# EAGLE design pic_can_relay (EAGLE 6.5.0)
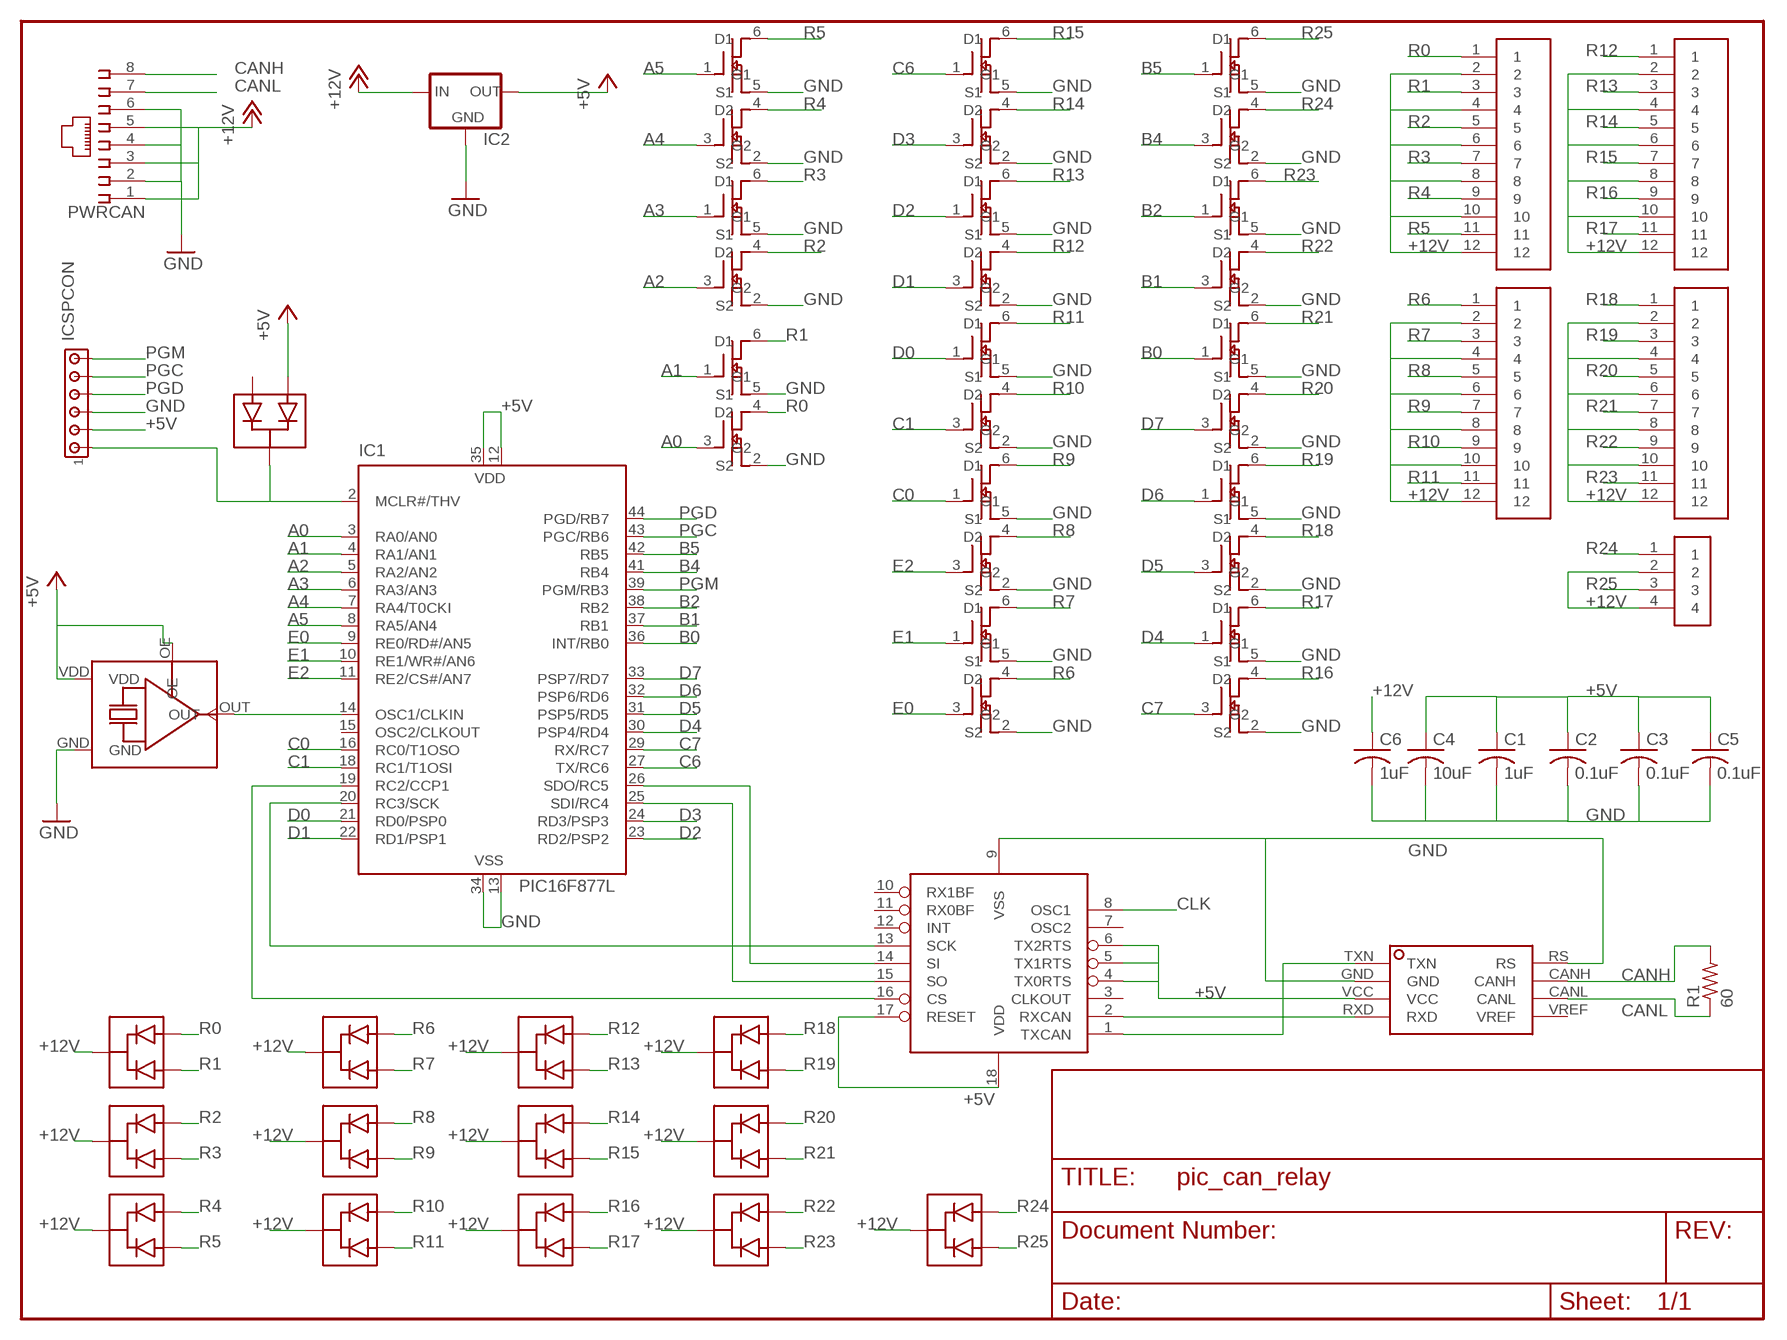
[diagram p0: schematic, sheet 1]

## Parts
C1  1uF  C-USC1206  [C1206]
C2  0.1uF  C-USC0805  [C0805]
C3  0.1uF  C-USC0805  [C0805]
C4  10uF  C-USC1210  [C1210]
C5  0.1uF  C-USC0805  [C0805]
C6  1uF  C-USC1206  [C1206]
D1  BAV70_  [SOT-23]
D2  BAV70_  [SOT-23]
D3  BAV70_  [SOT-23]
D4  BAV70_  [SOT-23]
D5  BAV70_  [SOT-23]
D6  BAV70_  [SOT-23]
D7  BAV70_  [SOT-23]
D8  BAV70_  [SOT-23]
D9  BAV70_  [SOT-23]
D10  BAV70_  [SOT-23]
D11  BAV70_  [SOT-23]
D12  BAV70_  [SOT-23]
D13  BAV70_  [SOT-23]
D14  BAV70_  [SOT-23]
IC1  PIC16F877L  [PLCC-44]
IC2  78XXL  [78XXL]
IC3  UC5350D  [SOIC8]
ICSPCON  MTA06-100  [10X06MTA]
MCP1  MCP2510-I/SO  [SO-18W]
PWRCAN  555764-1  [555764-1]
R1  60  R-US_R0805  [R0805]
T1  NDC7002N"  [SOT-6]
T2  NDC7002N"  [SOT-6]
T3  NDC7002N"  [SOT-6]
T4  NDC7002N"  [SOT-6]
T5  NDC7002N"  [SOT-6]
T6  NDC7002N"  [SOT-6]
T7  NDC7002N"  [SOT-6]
T8  NDC7002N"  [SOT-6]
T9  NDC7002N"  [SOT-6]
T10  NDC7002N"  [SOT-6]
T11  NDC7002N"  [SOT-6]
T12  NDC7002N"  [SOT-6]
T13  NDC7002N"  [SOT-6]
TB1  MPT0.5/12-2.54  [MPT0.5/12-2.54]
TB2  MPT0.5/12-2.54  [MPT0.5/12-2.54]
TB3  MPT0.5/12-2.54  [MPT0.5/12-2.54]
TB4  MPT0.5/12-2.54  [MPT0.5/12-2.54]
TB5  MPT0.5/4-2.54"  [MPT0.5/4-2.54]
U$1  SG-615P  [SG-615]

## Nets
+5V: C1.1 C2.1 C3.1 C4.1 C5.1 D1.1(A1) IC1.12(VDD) IC1.35(VDD) IC2.OUT IC3.VCC ICSPCON.5 MCP1.4(TX0RTS) MCP1.5(TX1RTS) MCP1.6(TX2RTS) MCP1.17(RESET) MCP1.18(VDD) U$1.OE U$1.VDD
+12V: C6.1 D2.3(C) D3.3(C) D4.3(C) D5.3(C) D6.3(C) D7.3(C) D8.3(C) D9.3(C) D10.3(C) D11.3(C) D12.3(C) D13.3(C) D14.3(C) IC2.IN PWRCAN.1 PWRCAN.3 PWRCAN.5 TB1.2 TB1.4 TB1.6 TB1.8 TB1.10 TB1.12 TB2.2 TB2.4 TB2.6 TB2.8 TB2.10 TB2.12 TB3.2 TB3.4 TB3.6 TB3.8 TB3.10 TB3.12 TB4.2 TB4.4 TB4.6 TB4.8 TB4.10 TB4.12 TB5.2 TB5.4
A0: IC1.3(RA0/AN0) T1.3(G2)
A1: IC1.4(RA1/AN1) T1.1(G1)
A2: IC1.5(RA2/AN2) T2.3(G2)
A3: IC1.6(RA3/AN3) T2.1(G1)
A4: IC1.7(RA4/T0CKI) T3.3(G2)
A5: IC1.8(RA5/AN4) T3.1(G1)
B0: IC1.36(INT/RB0) T11.1(G1)
B1: IC1.37(RB1) T12.3(G2)
B2: IC1.38(RB2) T12.1(G1)
B4: IC1.41(RB4) T13.3(G2)
B5: IC1.42(RB5) T13.1(G1)
C0: IC1.16(RC0/T1OSO) T5.1(G1)
C1: IC1.18(RC1/T1OSI) T6.3(G2)
C6: IC1.27(TX/RC6) T8.1(G1)
C7: IC1.29(RX/RC7) T9.3(G2)
CANH: IC3.CANH PWRCAN.8 R1.2
CANL: IC3.CANL PWRCAN.7 R1.1
CLK: IC1.14(OSC1/CLKIN) MCP1.8(OSC1) U$1.OUT
D0: IC1.21(RD0/PSP0) T6.1(G1)
D1: IC1.22(RD1/PSP1) T7.3(G2)
D2: IC1.23(RD2/PSP2) T7.1(G1)
D3: IC1.24(RD3/PSP3) T8.3(G2)
D4: IC1.30(PSP4/RD4) T9.1(G1)
D5: IC1.31(PSP5/RD5) T10.3(G2)
D6: IC1.32(PSP6/RD6) T10.1(G1)
D7: IC1.33(PSP7/RD7) T11.3(G2)
E0: IC1.9(RE0/RD#/AN5) T4.3(G2)
E1: IC1.10(RE1/WR#/AN6) T4.1(G1)
E2: IC1.11(RE2/CS#/AN7) T5.3(G2)
GND: C1.2 C2.2 C3.2 C4.2 C5.2 C6.2 IC1.13(VSS) IC1.34(VSS) IC2.GND IC3.GND IC3.RS ICSPCON.4 MCP1.9(VSS) PWRCAN.2 PWRCAN.4 PWRCAN.6 T1.2(S2) T1.5(S1) T2.2(S2) T2.5(S1) T3.2(S2) T3.5(S1) T4.2(S2) T4.5(S1) T5.2(S2) T5.5(S1) T6.2(S2) T6.5(S1) T7.2(S2) T7.5(S1) T8.2(S2) T8.5(S1) T9.2(S2) T9.5(S1) T10.2(S2) T10.5(S1) T11.2(S2) T11.5(S1) T12.2(S2) T12.5(S1) T13.2(S2) T13.5(S1) U$1.GND
N$3: IC1.25(SDI/RC4) MCP1.15(SO)
N$4: IC1.26(SDO/RC5) MCP1.14(SI)
N$5: IC1.20(RC3/SCK) MCP1.13(SCK)
N$6: D1.3(C) IC1.2(MCLR#/THV) ICSPCON.6
N$7: IC3.TXN MCP1.1(TXCAN)
N$8: IC3.RXD MCP1.2(RXCAN)
N$12: IC1.19(RC2/CCP1) MCP1.16(CS)
PGC: IC1.43(PGC/RB6) ICSPCON.2
PGD: IC1.44(PGD/RB7) ICSPCON.3
PGM: IC1.39(PGM/RB3) ICSPCON.1
R0: D2.2(A2) T1.4(D2) TB1.1
R1: D2.1(A1) T1.6(D1) TB1.3
R2: D3.2(A2) T2.4(D2) TB1.5
R3: D3.1(A1) T2.6(D1) TB1.7
R4: D4.2(A2) T3.4(D2) TB1.9
R5: D4.1(A1) T3.6(D1) TB1.11
R6: D5.2(A2) T4.4(D2) TB2.1
R7: D5.1(A1) T4.6(D1) TB2.3
R8: D6.2(A2) T5.4(D2) TB2.5
R9: D6.1(A1) T5.6(D1) TB2.7
R10: D7.2(A2) T6.4(D2) TB2.9
R11: D7.1(A1) T6.6(D1) TB2.11
R12: D8.2(A2) T7.4(D2) TB3.1
R13: D8.1(A1) T7.6(D1) TB3.3
R14: D9.2(A2) T8.4(D2) TB3.5
R15: D9.1(A1) T8.6(D1) TB3.7
R16: D10.2(A2) T9.4(D2) TB3.9
R17: D10.1(A1) T9.6(D1) TB3.11
R18: D11.2(A2) T10.4(D2) TB4.1
R19: D11.1(A1) T10.6(D1) TB4.3
R20: D12.2(A2) T11.4(D2) TB4.5
R21: D12.1(A1) T11.6(D1) TB4.7
R22: D13.2(A2) T12.4(D2) TB4.9
R23: D13.1(A1) T12.6(D1) TB4.11
R24: D14.2(A2) T13.4(D2) TB5.1
R25: D14.1(A1) T13.6(D1) TB5.3
Unconnected: D1.2(A2) IC1.15(OSC2/CLKOUT) IC3.VREF MCP1.3(CLKOUT) MCP1.7(OSC2) MCP1.10(RX1BF) MCP1.11(RX0BF) MCP1.12(INT)

## Library data of the parts
C1-C6 = rcl:C-US: CAPACITOR, American symbol
D1-D14 = house:BAV70: Fairchild Semiconductor Small Signal, Dual, Common Cathode, SOT-23 Diode
IC1 = microchip:PIC16F87*: MICROCONTROLLER
IC2 = v-reg:78XXL: VOLTAGE REGULATOR
IC3 = house:UC5350: CAN Tranceiver
ICSPCON = con-amp:MTA06-100: AMP CONNECTOR
MCP1 = microchip:MCP2510
PWRCAN = con-amp:555764-1: AMP CONNECTOR
R1 = rcl:R-US_: RESISTOR, American symbol
T1-T13 = house:NDC7002N: Farichild Dual N-Channel Enhancement Mode MOSFET
TB1-TB4 = house:MPT0.5: Pheonix Contact Micro-Pitch Terminal Block
TB5 = house:MPT0.5/4-2.54: Pheonix Contact Micro-Pitch Terminal Block
U$1 = house:SG-615: Epson Electronics CMOS/TTL SMD Oscillator

## Board
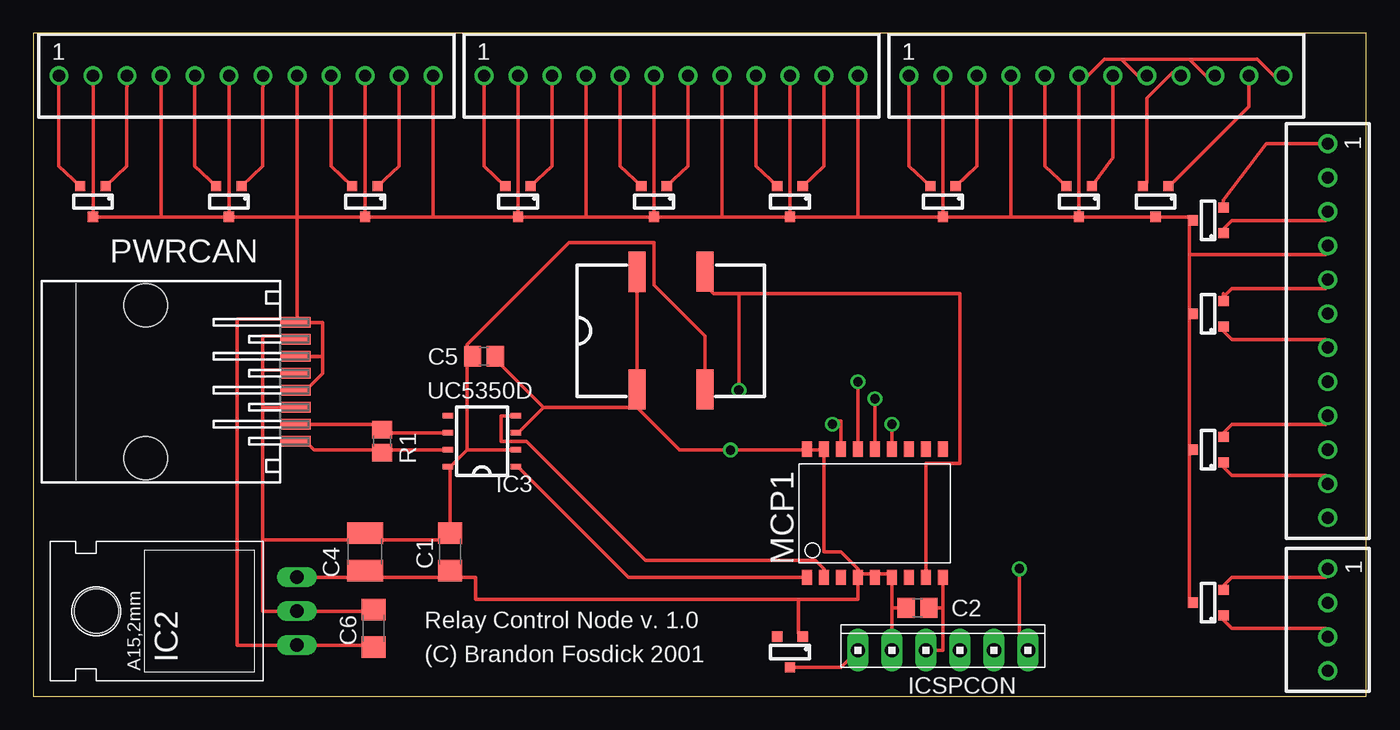
[diagram p1: board, top side]
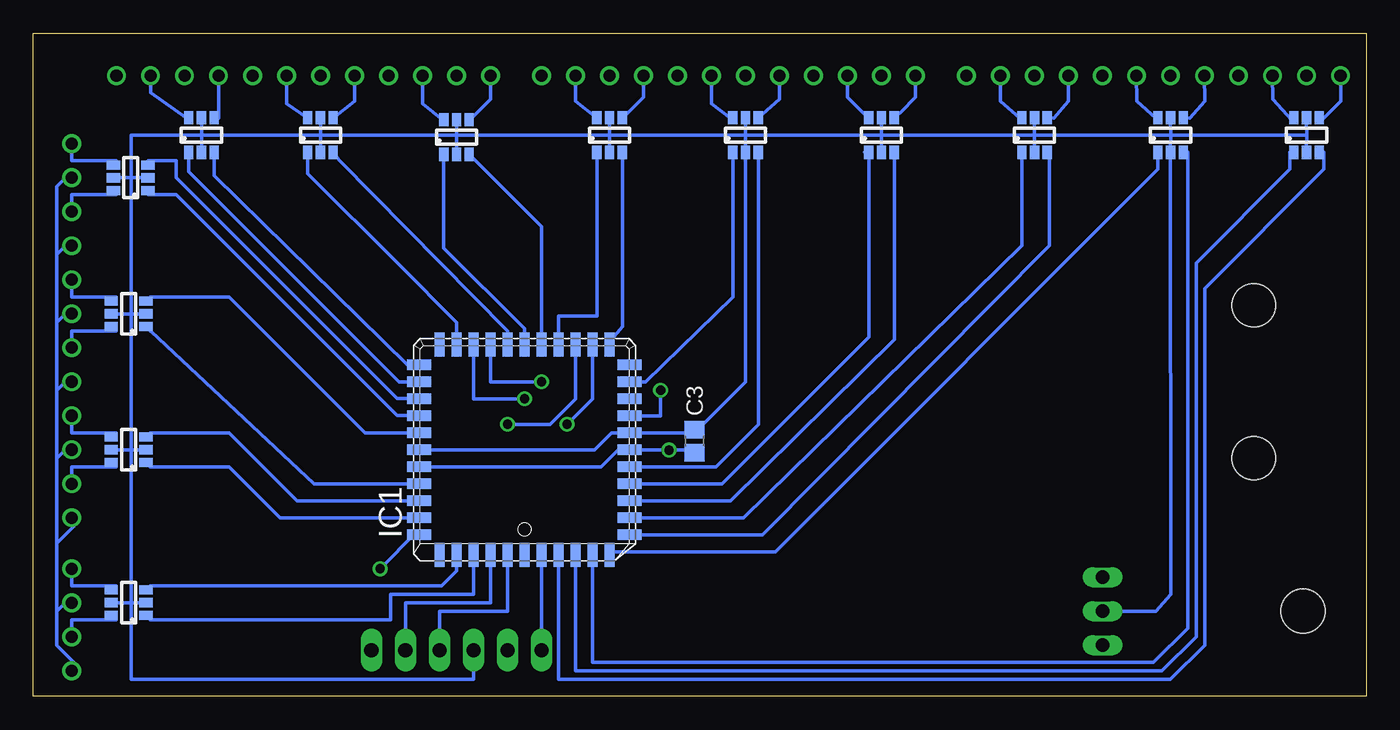
[diagram p2: board, bottom side, seen from below]

Size 99.55 x 49.55 mm. Coordinates in mm from the lower left corner, seen from the top.
Outline: 0,0 99.55,0 99.55,49.55 0,49.55 0,0
Copper layers (1*16): Top 0.035mm / dielectric 1.5mm / Bottom 0.035mm
Design rules "default": minimum track width 10mil, minimum drill 24mil, track to track 8mil, track to pad 8mil, pad to pad 8mil, via to via 8mil, smd to smd 8mil, copper to edge 40mil, drill to drill 8mil, minimum pad ring 10mil, minimum via ring 8mil, stop-mask expansion 0mil, vias tented up to drill 0mil, thermal gap 10mil

### Footprints (pad centres in the part's own frame; a part is rotated, then mirrored left to right if it is on the bottom)
C1206 = smd 1.6 x 1.8: 1 -1.4,0; 2 1.4,0
C0805 = smd 1.3 x 1.5: 1 -0.85,0; 2 0.85,0
C1210 = smd 1.6 x 2.7: 1 -1.4,0; 2 1.4,0
SOT-23 = smd 0.76 x 0.76: 1 -0.95,0; 2 0.95,0; 3 0,2.29
PLCC-44 = smd 1.8 x 0.76: 1 -7.86,0; 2 -7.86,-1.27; 3 -7.86,-2.54; 4 -7.86,-3.81; 5 -7.86,-5.08; 6 -7.86,-6.35; 18 7.86,-6.35; 19 7.86,-5.08; 20 7.86,-3.81; 21 7.86,-2.54; 22 7.86,-1.27; 23 7.86,0; 24 7.86,1.27; 25 7.86,2.54; 26 7.86,3.81; 27 7.86,5.08; 28 7.86,6.35; 40 -7.86,6.35; 41 -7.86,5.08; 42 -7.86,3.81; 43 -7.86,2.54; 44 -7.86,1.27 | smd 0.76 x 1.8: 7 -6.35,-7.86; 8 -5.08,-7.86; 9 -3.81,-7.86; 10 -2.54,-7.86; 11 -1.27,-7.86; 12 0,-7.86; 13 1.27,-7.86; 14 2.54,-7.86; 15 3.81,-7.86; 16 5.08,-7.86; 17 6.35,-7.86; 29 6.35,7.86; 30 5.08,7.86; 31 3.81,7.86; 32 2.54,7.86; 33 1.27,7.86; 34 0,7.86; 35 -1.27,7.86; 36 -2.54,7.86; 37 -3.81,7.86; 38 -5.08,7.86; 39 -6.35,7.86
78XXL = drill 1 long: GND 0,-3.81; IN -2.54,-3.81; OUT 2.54,-3.81 | hole 3.302: 0,11.176
SOIC8 = smd 0.813 x 0.406: CANH 2.54,1.27; CANL 2.54,0; GND -2.54,1.27; RS 2.54,2.54; RXD -2.54,-1.27; TXN -2.54,2.54; VCC -2.54,0; VREF 2.54,-1.27
10X06MTA = drill 1.067 long: 1 6.35,0; 2 3.81,0; 3 1.27,0; 4 -1.27,0; 5 -3.81,0; 6 -6.35,0
SO-18W = smd 0.762 x 1.143: 1 -5.08,-4.788; 2 -3.81,-4.788; 3 -2.54,-4.788; 4 -1.27,-4.788; 5 0,-4.788; 6 1.27,-4.788; 7 2.54,-4.788; 8 3.81,-4.788; 9 5.08,-4.788; 10 5.08,4.788; 11 3.81,4.788; 12 2.54,4.788; 13 1.27,4.788; 14 0,4.788; 15 -1.27,4.788; 16 -2.54,4.788; 17 -3.81,4.788; 18 -5.08,4.788
555764-1 = smd 0.813 x 2.286: 1 -4.445,10.033; 2 -3.175,10.033; 3 -1.905,10.033; 4 -0.635,10.033; 5 0.635,10.033; 6 1.905,10.033; 7 3.175,10.033; 8 4.445,10.033 | hole 3.251: -5.715,-1.143; 5.715,-1.143
R0805 = smd 1.3 x 1.5: 1 -0.85,0; 2 0.85,0
SOT-6 = smd 0.69 x 0.99: 1 -0.95,0; 2 0,0; 3 0.95,0; 4 0.95,2.59; 5 0,2.59; 6 -0.95,2.59
MPT0.5/12-2.54 = drill 0.9: 1 -12.7,0; 2 -10.16,0; 3 -7.62,0; 4 -5.08,0; 5 -2.54,0; 6 0,0; 7 2.54,0; 8 5.08,0; 9 7.62,0; 10 10.16,0; 11 12.7,0; 12 15.24,0
MPT0.5/4-2.54 = drill 0.9: 1 -5.08,0; 2 -2.54,0; 3 0,0; 4 2.54,0
SG-615 = smd 1.27 x 3: GND 2.54,-4.4; OE -2.54,-4.4; OUT 2.54,4.41; VDD -2.54,4.4

### Placement (x,y rotation side)
C1  31.11,10.82 90 top
C2  66.04,6.63 0 top
C3  50.16,19.08 90 bottom
C4  24.77,10.82 90 top
C5  33.66,25.43 180 top
C6  25.4,5.11 90 top
D1  56.52,4.47 180 top
D2  4.45,38.13 180 top
D3  14.61,38.13 180 top
D4  24.77,38.13 180 top
D5  36.2,38.13 180 top
D6  46.35,38.13 180 top
D7  56.52,38.13 180 top
D8  67.94,38.13 180 top
D9  78.11,38.13 180 top
D10  83.82,38.13 180 top
D11  88.9,35.59 90 top
D12  88.9,28.6 90 top
D13  88.9,18.44 90 top
D14  88.9,7.01 90 top
IC1  62.86,18.44 90 bottom
IC2  15.87,6.38 90 top
IC3  33.5,19.71 180 top
ICSPCON  67.94,3.46 0 top
MCP1  62.86,13.69 0 top
PWRCAN  9.52,23.52 270 top
R1  26.03,19.08 270 top
T1  4.45,40.67 0 bottom
T2  14.6,40.67 0 bottom
T3  24.76,40.67 0 bottom
T4  36.19,40.67 0 bottom
T5  46.35,40.67 0 bottom
T6  56.51,40.67 0 bottom
T7  67.94,40.51 0 bottom
T8  78.1,40.67 0 bottom
T9  86.99,40.67 0 bottom
T10  90.99,38.76 90 bottom
T11  91.14,28.6 90 bottom
T12  91.14,18.44 90 bottom
T13  91.14,7.01 90 bottom
TB1  14.6,46.38 0 top
TB2  46.35,46.38 0 top
TB3  78.1,46.38 0 top
TB4  96.7,28.6 270 top
TB5  96.7,4.47 270 top
U$1  47.62,27.33 0 top

### Tracks (layer width: path | path; a pad name or v marks a point on that pad's centre or on a via)
+5V  (via drill 0.7)
  Top 0.254: 62.7,9.16 61.43,9.16 MCP1.4 61.59,9.16 | 62.7,9.16 63.97,9.16 MCP1.6 64.13,9.16 64.13,6.62 | 62.7,9.16 MCP1.5 | 57.14,7.26 33.01,7.26 33.01,8.91 30.47,8.91 | 30.47,8.91 23.74,8.91 C4.1 23.5,8.89 20.95,8.89 IC2.OUT | 64.13,6.62 64.13,4.72 ICSPCON.5 | 61.59,9.16 61.59,7.26 57.14,7.26 | 57.14,7.26 56.51,7.26 57.14,7.26 | 57.14,7.26 57.14,4.72 D1.1 | 57.14,7.26 | 64.13,6.62 C2.1 | 30.47,8.91 C1.1 | U$1.VDD U$1.OE 45.09,21.59 | 38.1,21.59 36.2,19.68 IC3.VCC | 45.09,21.59 38.1,21.59 | 38.1,21.59 34.92,24.77 C5.1 | 59.05,18.41 57.78,18.41 | 57.78,18.41 v52.07,18.41 48.26,18.41 45.09,21.59 | 57.78,18.41 MCP1.18 | 59.05,18.41 59.05,10.79 60.33,10.79 61.59,9.53 61.59,9.16 | 59.05,18.41 MCP1.17
  Bottom 0.254: C3.1 50.79,18.44 52.07,18.44 | 52.07,18.44 IC1.12 55.88,18.41 57.15,17.14 69.85,17.14 | 71.12,17.14 IC1.35 69.85,17.14 | v52.07,18.41 52.07,18.44 | 69.85,17.14 70.48,17.14
+12V
  Top 0.254: 72.86,46.63 TB3.4 73.03,45.72 73.03,35.84 | TB3.2 67.94,46.63 | TB3.6 77.94,46.63 | 83.18,46.63 TB3.8 82.55,46.35 81.28,47.62 | 17.77,35.84 17.61,35.84 | 19.52,35.84 17.77,35.84 | 19.52,35.84 21.43,35.84 21.58,35.84 D4.3 | 16.5,28.21 19.68,28.21 | 16.5,28.21 | 19.68,28.21 19.68,37.1 | 19.68,28.21 PWRCAN.1 20.32,27.94 21.59,27.94 21.59,25.4 | 19.68,37.1 TB1.8 | D9.3 D10.3 | 86.35,35.84 86.35,33.02 | 86.35,33.02 86.35,28.85 | 86.35,28.85 D12.3 | D10.3 86.35,35.84 | D10.3 | 86.35,35.84 D11.3 | 17.77,35.84 D3.3 | D3.3 14.61,45.72 TB1.6 | 17.77,35.84 | D4.3 24.77,45.72 TB1.10 | D14.3 86.35,7.26 86.35,18.69 | 86.35,18.69 D13.3 | 4.44,45.99 TB1.2 4.45,45.72 D2.3 9.53,35.84 | 36.19,45.99 TB2.2 36.2,45.72 D5.3 | D5.3 41.27,35.84 | 41.27,35.84 D6.3 | D6.3 51.44,35.84 | 51.44,35.84 D7.3 | D7.3 56.52,45.72 TB2.10 | D6.3 46.35,45.72 TB2.6 | TB3.2 67.94,45.99 | 19.52,35.84 19.68,35.84 19.68,37.1 | D8.3 73.03,35.84 | 73.03,35.84 D9.3 | D9.3 78.11,45.72 TB3.6 | D8.3 67.94,45.72 TB3.2 | D4.3 29.84,35.84 | 29.84,35.84 D5.3 | D7.3 61.59,35.84 | 61.59,35.84 D8.3 | 86.35,28.85 86.35,18.69 | D3.3 9.53,35.84 | 16.5,28.21 15.23,28.21 15.23,3.83 IC2.IN 24.76,3.83 C6.1 | 16.5,28.21 | TB1.4 9.53,45.72 9.53,35.84 | TB1.12 29.84,45.72 29.84,35.84 | TB2.4 41.27,45.72 41.27,35.84 | TB2.8 51.44,45.72 51.44,35.84 | TB2.12 61.59,45.72 61.59,35.84 | 81.28,47.62 80.01,47.62 78.74,46.35 TB3.6 | 86.36,47.62 87.63,46.35 TB3.10 | 81.28,47.62 86.36,47.62 | 86.36,47.62 91.44,47.62 92.71,46.35 TB3.12 | TB4.4 96.52,33.02 86.35,33.02 | 21.59,25.4 21.59,24.13 20.32,22.86 PWRCAN.5 | 21.59,25.4 20.32,25.4 PWRCAN.3
  Bottom 0.254: 97.79,6.35 97.79,3.81 96.52,2.54 TB5.4 | 97.79,6.35 97.16,6.99 TB5.2 | 97.79,11.43 96.52,12.7 TB4.12 | 97.79,11.43 97.79,6.35 | 97.79,17.78 97.16,18.41 TB4.10 | 97.79,17.78 97.79,11.43 | 97.79,22.86 97.16,23.5 TB4.8 | 97.79,22.86 97.79,17.78 | 97.79,27.94 97.16,28.57 TB4.6 | 97.79,27.94 97.79,22.86 | 97.79,33.02 97.16,33.66 TB4.4 | 97.79,33.02 97.79,27.94 | 97.79,33.02 97.79,38.1 97.16,38.73 TB4.2
A0
  Bottom 0.254: 3.17,40.66 3.17,39.39 12.06,30.5 12.06,3.83 14.62,1.27 60.32,1.27 IC1.3 | 3.17,40.66 T1.3 | 3.17,40.66
A1
  Bottom 0.254: 5.71,40.66 5.71,39.39 12.69,32.41 12.69,4.47 15.25,1.91 59.05,1.91 IC1.4 | 5.71,40.66 T1.1 | 5.71,40.66
A2
  Bottom 0.254: T2.3 13.33,40.66 13.33,5.1 15.88,2.54 57.78,2.54 IC1.5
A3
  Bottom 0.254: T2.1 15.55,39.39 44.13,10.82 56.35,10.82 IC1.6
A4
  Bottom 0.254: T3.3 23.65,40.66 23.65,33.68 45.08,12.09 54.45,12.09 IC1.7
A5
  Bottom 0.254: T3.1 25.71,33.68 46.51,13.36 54.45,13.36 IC1.8
B0
  Bottom 0.254: T11.1 90.82,27.33 90.8,27.33 78.58,15.9 70.95,15.9 IC1.36
B1
  Bottom 0.254: T12.3 90.82,19.71 84.92,19.71 79.84,14.63 70.95,14.63 IC1.37
B2
  Bottom 0.254: T12.1 90.82,17.17 84.92,17.17 81.11,13.36 70.95,13.36 IC1.38
B4
  Bottom 0.254: T13.3 90.82,8.28 69.05,8.28 67.94,9.39 IC1.41
B5
  Bottom 0.254: T13.1 90.82,5.74 72.86,5.74 72.86,7.64 69.05,7.64 66.67,7.64 IC1.42
C0
  Bottom 0.254: T5.1 47.3,40.03 47.3,29.87 53.81,23.52 54.45,23.52 IC1.16
C1
  Bottom 0.254: T6.3 55.56,40.03 55.56,27.64 56.35,26.69 IC1.18
C6
  Bottom 0.254: T8.1 79.05,39.87 79.05,39.08 72.22,32.26 67.94,27.96 IC1.27
C7
  Bottom 0.254: T9.3 86.04,38.91 71.59,24.79 IC1.29
CANH
  Top 0.254: IC3.CANH 31.11,18.41 26.67,18.41 R1.2 25.4,18.41 20.95,18.41 20.32,19.05 PWRCAN.8
CANL
  Top 0.254: IC3.CANL 31.11,19.68 26.67,19.68 R1.1 25.4,20.32 20.32,20.32 PWRCAN.7
CLK  (via drill 0.7)
  Top 0.254: 52.7,30.12 69.21,30.12 69.21,17.42 66.67,17.42 66.67,9.16 MCP1.8 | 52.7,30.12 52.7,23.14 52.7,22.86 v52.7,22.88 | 52.7,30.12 50.79,30.12 50.16,30.75 U$1.OUT | 52.7,30.12
  Bottom 0.254: v52.7,22.88 52.7,20.98 54.45,20.98 IC1.14
D0
  Bottom 0.254: T6.1 57.46,28.44 60.32,28.44 60.32,26.06 IC1.21
D1
  Bottom 0.254: T7.3 66.51,40.03 61.59,35.1 IC1.22
D2
  Bottom 0.254: T7.1 68.89,39.87 68.89,33.52 62.86,27.48 IC1.23
D3
  Bottom 0.254: T8.3 76.67,40.03 64.13,27.33 IC1.24
D4
  Bottom 0.254: T9.1 87.94,40.03 87.94,39.23 72.22,23.52 70.95,23.52 IC1.30
D5
  Bottom 0.254: 70.95,22.25 IC1.31 72.39,22.25 88.9,38.76 88.9,40.03 90.96,40.03 T10.3
D6
  Bottom 0.254: T10.1 90.96,37.49 88.9,37.49 72.39,20.98 IC1.32
D7
  Bottom 0.254: T11.3 90.82,29.87 84.92,29.87 74.77,19.71 70.95,19.71 IC1.33
E0
  Bottom 0.254: T4.3 35.24,26.69 47.46,14.63 54.45,14.63 IC1.9
E1
  Bottom 0.254: IC1.10 54.45,15.9 48.09,15.9 37.14,26.85 T4.1 37.46,40.66 T4.1
E2
  Bottom 0.254: T5.3 45.4,40.03 45.4,20.34 48.57,17.17 54.45,17.17 IC1.11
GND
  Top 0.254: 17.14,22.02 17.15,22.02 17.14,21.86 | 17.14,24.41 18.89,24.41 PWRCAN.4 | PWRCAN.6 18.89,21.86 | 17.14,24.41 17.14,26.95 18.89,26.95 PWRCAN.2 | 32.38,18.44 IC3.GND | PWRCAN.6 20.16,21.86 | 67.94,6.62 67.94,3.45 66.51,3.45 ICSPCON.4 | 67.94,6.62 67.94,9.16 MCP1.9 | 32.38,18.44 32.38,21.86 | 17.14,22.02 17.14,24.41 | 67.94,6.62 C2.2 | 67.94,6.62 | 32.38,21.86 32.38,25.04 C5.2 32.38,26.04 32.38,26.31 40,33.93 46.35,33.93 46.35,30.75 50.16,26.95 U$1.GND | 32.38,21.86 | 17.14,21.86 17.14,22.02 | C6.2 24.76,6.37 IC2.GND 17.14,6.37 17.14,11.71 | 17.14,11.71 17.14,21.59 | 17.14,21.59 17.14,21.86 | 17.14,11.71 23.49,11.71 C4.2 26.03,11.71 30.47,11.71 C1.2 31.11,17.14 | 31.11,17.14 32.38,18.41 32.38,18.44 | 31.11,17.14 IC3.RS | PWRCAN.6 18.41,21.59 17.14,21.59
  Bottom 0.254: 36.19,41.93 T4.2 36.03,40.66 | 36.19,41.93 T4.5 | 24.76,41.93 T3.2 24.6,40.66 | 24.76,41.93 T3.5 | 14.6,41.93 T2.2 14.6,7.64 15.71,6.37 IC2.GND | 14.6,41.93 T2.5 | 14.6,41.93 24.76,41.93 | 24.76,41.93 36.19,41.93 | 67.94,41.93 T7.2 | 67.94,41.93 | 67.94,41.93 T7.5 | 46.35,41.93 T5.2 46.35,23.52 49.52,20.34 C3.2 50.79,19.71 IC1.13 56.35,19.71 57.62,18.44 69.69,18.44 IC1.34 | 46.35,41.93 T5.5 | 56.51,41.93 T6.2 | 56.51,41.93 T6.5 | 46.35,41.93 56.51,41.93 | 56.51,41.93 67.94,41.93 | 36.19,41.93 46.35,41.93 | 86.99,41.93 T9.2 | 86.99,41.93 | 86.99,41.93 T9.5 | 78.1,41.93 T8.2 | 78.1,41.93 | 78.1,41.93 T8.5 | 14.6,41.93 4.44,41.93 | 78.1,41.93 86.99,41.93 | 92.25,7.01 93.36,7.01 T13.5 | 92.25,7.01 90.82,7.01 T13.2 | 92.25,18.44 90.82,18.44 T12.2 | 92.25,18.44 92.25,7.01 | 92.25,28.6 90.82,28.6 T11.2 | 92.25,38.76 93.36,38.76 T10.5 | 92.25,38.76 90.82,38.76 T10.2 | 92.25,28.6 93.36,28.6 T11.5 | 92.25,38.76 92.25,28.6 | 92.25,18.44 93.36,18.44 T12.5 | 92.25,28.6 92.25,18.44 | 86.99,41.93 92.25,41.93 92.25,38.76 | 67.94,41.93 78.1,41.93 | 92.25,7.01 92.25,1.27 66.67,1.27 ICSPCON.4 | 4.44,41.93 T1.2 | 4.44,41.93 T1.5
N$3  (via drill 0.7)
  Top 0.254: 61.59,23.5 61.59,18.69 MCP1.15 | 61.59,23.5 v61.59,23.52 | v61.59,23.52 61.59,23.77 | 61.59,23.5 v61.59,23.52
  Bottom 0.254: v61.59,23.52 65.4,23.52 IC1.25
N$4  (via drill 0.7)
  Top 0.254: 62.86,22.23 62.86,18.69 MCP1.14 | 62.86,22.23 v62.86,22.25 | v62.86,22.25 62.86,22.5 | 62.86,22.23 62.87,22.23 v62.86,22.25
  Bottom 0.254: v62.86,22.25 66.67,22.25 IC1.26
N$5  (via drill 0.7)
  Top 0.254: 64.13,20.32 64.13,18.69 MCP1.13 | v64.13,20.34 64.13,20.32 | v64.13,20.34 64.13,20.59 | 64.13,20.32 64.14,20.32 v64.13,20.34
  Bottom 0.254: v64.13,20.34 62.86,20.34 60.95,20.34 59.05,22.25 IC1.20
N$6
  Top 0.254: D1.3 60.32,2.18 ICSPCON.6
  Bottom 0.254: ICSPCON.6 61.59,10.34 61.43,10.5 IC1.2
N$7
  Top 0.254: IC3.TXN 36.2,17.14 44.45,8.89 MCP1.1
N$8
  Top 0.254: 58.89,9.16 MCP1.2 59.05,9.53 58.42,10.16 45.72,10.16 36.83,19.05 34.92,19.05 34.92,20.95 36.2,20.95 IC3.RXD
N$12  (via drill 0.7)
  Top 0.254: 59.69,20.59 60.32,20.59 60.32,18.69 MCP1.16 | 59.69,20.59 59.68,20.59 | 59.69,20.59 59.69,20.32 v59.68,20.34
  Bottom 0.254: v59.68,20.34 57.78,22.25 IC1.19
PGC
  Bottom 0.254: IC1.43 65.4,7.01 68.42,7.01 71.75,7.01 ICSPCON.2 71.59,3.2
PGD
  Bottom 0.254: IC1.44 64.05,10.58 64.13,10.66 64.13,6.37 69.05,6.37 69.21,6.37 ICSPCON.3
PGM  (via drill 0.7)
  Top 0.254: ICSPCON.1 73.66,4.45 73.66,9.53 v73.65,9.55
  Bottom 0.254: v73.65,9.55 70.95,12.24 IC1.39
R0
  Top 0.254: TB1.1 1.9,45.36 1.9,39.65 D2.2
  Bottom 0.254: T1.4 3.17,43.2 1.9,44.47 1.9,45.74 TB1.1
R1
  Top 0.254: D2.1 6.98,39.65 6.98,44.73 TB1.3
  Bottom 0.254: TB1.3 6.98,44.63 5.56,43.05 5.71,43.2 T1.6
R2
  Top 0.254: D3.2 12.06,39.65 12.06,45.99 TB1.5
  Bottom 0.254: T2.4 13.17,43.2 12.06,44.47 TB1.5
R3
  Top 0.254: D3.1 17.14,39.65 17.14,44.73 TB1.7
  Bottom 0.254: T2.6 15.71,43.2 17.14,44.47 TB1.7
R4
  Top 0.254: D4.2 22.22,39.65 22.22,45.99 TB1.9
  Bottom 0.254: T3.4 23.33,43.2 22.22,44.47 TB1.9
R5
  Top 0.254: D4.1 27.3,39.65 27.3,44.73 TB1.11
  Bottom 0.254: T3.6 25.87,43.2 27.3,44.47 TB1.11
R6
  Top 0.254: D5.2 33.65,39.65 33.65,45.99 TB2.1
  Bottom 0.254: T4.4 34.76,43.68 33.65,44.79 TB2.1
R7
  Top 0.254: D5.1 38.73,39.65 38.73,44.73 TB2.3
  Bottom 0.254: T4.6 37.46,43.52 38.73,44.79 TB2.3
R8
  Top 0.254: D6.2 43.81,39.65 43.81,45.99 TB2.5
  Bottom 0.254: T5.4 45.08,43.52 43.81,44.63 TB2.5
R9
  Top 0.254: D6.1 48.89,39.65 48.89,44.73 TB2.7
  Bottom 0.254: T5.6 47.46,43.2 48.89,44.31 TB2.7
R10
  Top 0.254: D7.2 53.97,39.65 53.97,45.99 TB2.9
  Bottom 0.254: T6.4 55.56,43.2 53.97,44.79 TB2.9
R11
  Top 0.254: D7.1 59.05,39.65 59.05,44.73 TB2.11
  Bottom 0.254: T6.6 57.46,43.2 59.05,44.47 TB2.11
R12
  Top 0.254: D8.2 65.4,39.65 65.4,45.99 TB3.1
  Bottom 0.254: T7.4 66.99,43.04 65.4,44.63 TB3.1
R13
  Top 0.254: D8.1 70.48,39.65 70.48,44.73 TB3.3
  Bottom 0.254: T7.6 68.89,43.04 70.48,44.31 TB3.3
R14
  Top 0.254: D9.2 75.56,39.65 75.56,45.99 TB3.5
  Bottom 0.254: T8.4 77.15,43.2 75.56,44.47 TB3.5
R15
  Top 0.254: D9.1 80.64,40.28 80.64,45.36 TB3.7
  Bottom 0.254: T8.6 79.05,43.2 80.64,44.31 TB3.7
R16
  Top 0.254: D10.2 83.18,38.38 83.18,44.73 85.08,46.63 TB3.9
  Bottom 0.254: T9.4 85.72,43.2 TB3.9
R17
  Top 0.254: D10.1 85.08,38.38 90.8,44.09 90.8,45.99 TB3.11
  Bottom 0.254: T9.6 88.1,43.2 90.8,45.11 TB3.11
R18
  Top 0.254: D11.2 88.89,37.1 92.09,41.3 TB4.1
  Bottom 0.254: T10.4 93.36,40.03 96.69,40.03 TB4.1
R19
  Top 0.254: D11.1 88.9,34.92 89.53,35.56 96.52,35.56 TB4.3
  Bottom 0.254: T10.6 93.36,37.49 96.69,37.49 TB4.3
R20
  Top 0.254: 88.89,30.12 D12.2 88.9,29.84 89.53,30.48 96.52,30.48 TB4.5
  Bottom 0.254: T11.4 93.36,29.87 96.69,29.87 TB4.5
R21
  Top 0.254: 88.89,27.58 D12.1 88.9,27.3 89.53,26.67 96.52,26.67 TB4.7
  Bottom 0.254: T11.6 93.36,27.33 96.69,27.33 TB4.7
R22
  Top 0.254: D13.2 88.9,19.68 89.53,20.32 96.52,20.32 TB4.9
  Bottom 0.254: T12.4 93.36,19.71 96.69,19.71 TB4.9
R23
  Top 0.254: 88.89,17.42 D13.1 88.9,17.14 89.53,16.51 96.52,16.51 TB4.11
  Bottom 0.254: T12.6 93.36,17.17 96.69,17.17 TB4.11
R24
  Top 0.254: D14.2 88.9,8.26 89.53,8.89 96.52,8.89 TB5.1
  Bottom 0.254: T13.4 93.36,8.28 96.69,8.28 TB5.1
R25
  Top 0.254: D14.1 88.9,5.71 89.53,5.08 96.52,5.08 TB5.3
  Bottom 0.254: T13.6 93.36,5.74 96.69,5.74 TB5.3

### Text on the board
Top: 1 Top
Bottom: 16 Bottom
Pads: 17 Pads
Vias: 18 Vias
Dimension: 20 Dimension
tPlace: 21 tPlace
tNames: 25 tNames | Relay Control Node v. 1.0 | (C) Brandon Fosdick 2001
tStop: 29 tStop
bStop: 30 bStop